# Altium schematic sheet FOC_DRV8323.SchDoc
size A2; SheetNumber: 1; SheetTotal: 1
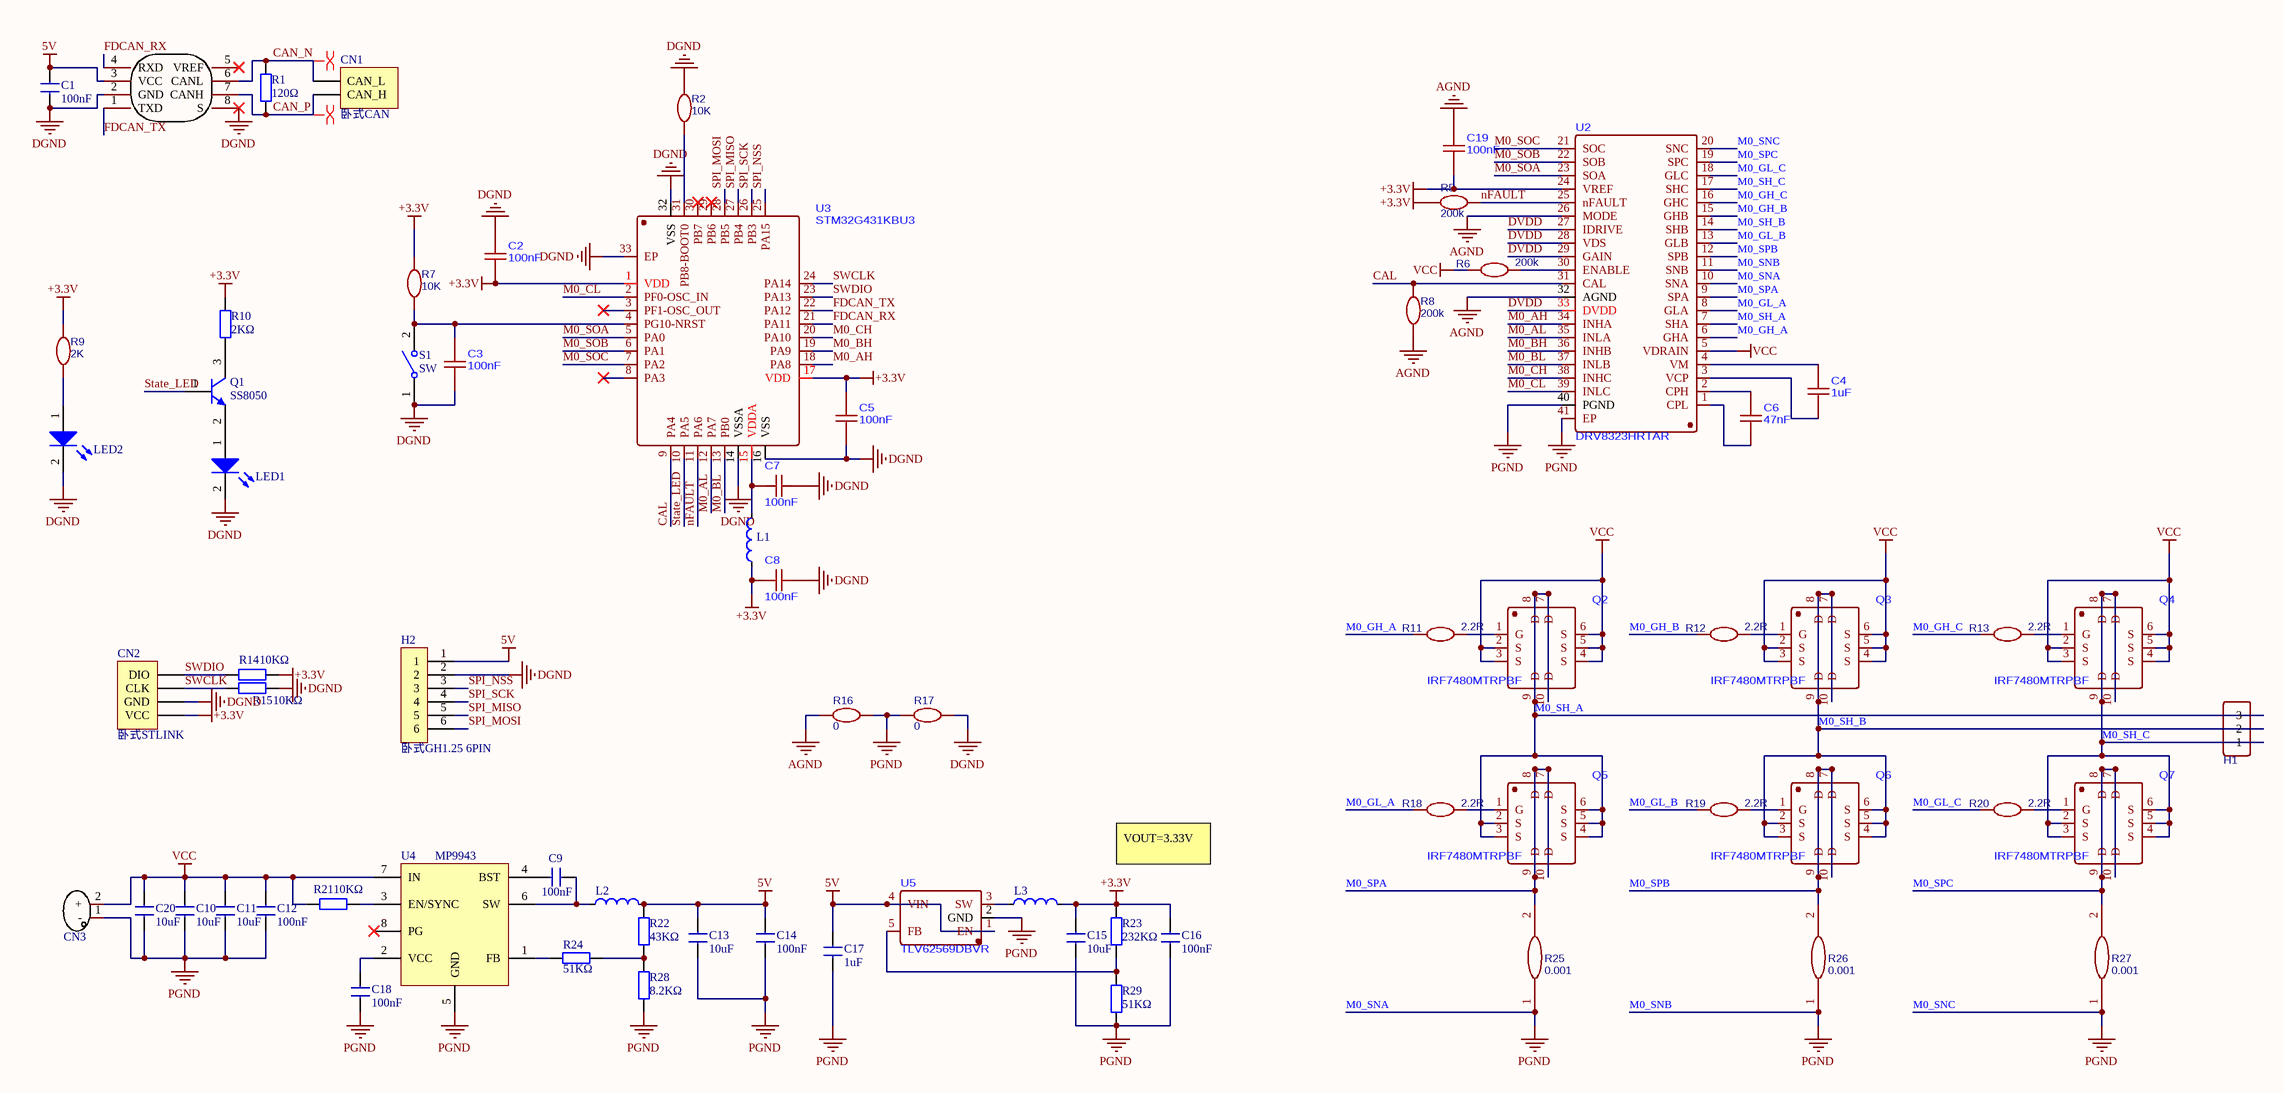
[diagram p0: FOC_DRV8323.SchDoc]

## Parts
C1  100nF  [c0402]
C2  100nF  [c0402]
C3  100nF  [c0402]
C4  1uF  [c0402]
C5  100nF  [c0402]
C6  47nF  [c0402]
C7  100nF  [c0402]
C8  100nF  [c0402]
C9  100nF  [c0402]
C10  10uF  [1210]
C11  10uF  [1210]
C12  100nF  [c0402]
C13  10uF  [1210]
C14  100nF  [c0402]
C15  10uF  [1210]
C16  100nF  [c0402]
C17  1uF  [c0402]
C18  100nF  [c0402]
C19  100nF  [c0402]
C20  10uF  [1210]
CN1  卧式CAN  [GH1.25 2P 卧式]
CN2  卧式STLINK  [CONN-SMD_4P-P1.25_GH1.25-4P]
CN3  XT30_1  [XT30卧式焊盘]  (value not drawn)
H1  MR30-M  [MR30]  (value not drawn)
H2  卧式GH1.25 6PIN  [CONN-SMD_6P-P1.25_XYECONN_XY-GH1.25-6A61]
L1  1008屏蔽电感  [R0603]  (value not drawn)
L2  1008屏蔽电感  [IND-SMD_L2.5-W2.0]  (value not drawn)
L3  1008屏蔽电感  [IND-SMD_L2.5-W2.0]  (value not drawn)
LED1  LED  [led0805]  (value not drawn)
LED2  LED  [led0805]  (value not drawn)
Q1  SS8050  [SOT-23-3_L2.9-W1.3-P1.90-LS2.4-BR]
Q2  IRF7480MTRPBF  [TRS-SMD_IRF7480MTRPBF]
Q3  IRF7480MTRPBF  [TRS-SMD_IRF7480MTRPBF]
Q4  IRF7480MTRPBF  [TRS-SMD_IRF7480MTRPBF]
Q5  IRF7480MTRPBF  [TRS-SMD_IRF7480MTRPBF]
Q6  IRF7480MTRPBF  [TRS-SMD_IRF7480MTRPBF]
Q7  IRF7480MTRPBF  [TRS-SMD_IRF7480MTRPBF]
R1  120Ω  [R0402]
R2  10K  [R0402]
R5  200k  [R0402]
R6  200k  [R0402]
R7  10K  [R0402]
R8  200k  [R0402]
R9  2K  [R0402]
R10  2KΩ  [R0402]
R11  2.2R  [R0402]
R12  2.2R  [R0402]
R13  2.2R  [R0402]
R14  10KΩ  [R0402]
R15  10KΩ  [R0402]
R16  0  [R0402]
R17  0  [R0402]
R18  2.2R  [R0402]
R19  2.2R  [R0402]
R20  2.2R  [R0402]
R21  10KΩ  [R0402]
R22  43KΩ  [R0402]
R23  232KΩ  [R0402]
R24  51KΩ  [R0402]
R25  0.001  [R0612]
R26  0.001  [R0612]
R27  0.001  [R0612]
R28  8.2KΩ  [R0402]
R29  51KΩ  [R0402]
S1  SW  [KEY_SMD]
U1  SN65HVD1050DR  [SOIC-8_L4.9-W3.9-P1.27-LS6.0-BL]  (value not drawn)
U2  DRV8323HRTAR  [QFN-40_L6.0-W6.0-P0.50-BL-EP4.5]
U3  STM32G431KBU3  [UFQFPN-32_L5.0-W5.0-P0.50-BL-EP3.5]
U4  MP9943  [QFN-8 3x3]
U5  TLV62569DBVR  [SOT-23-5_L3.0-W1.7-P0.95-LS2.8-BR]

## Nets
5V: C1.2 C13.2 C14.2 C17.2 H2.1 L2.2 R22.2 U1.3(VCC) U5.1(EN) U5.4(VIN)
+3.3V: C2.2 C5.2 C8.2 C15.2 C16.2 C19.1 CN2.1(VCC) L1.1 L3.2 R5.1 R7.1 R9.1 R10.2 R14.1 R23.2 U2.24(VREF) U3.1(VDD) U3.17(VDD)
AGND: C19.2 R8.2 R16.1 U2.26(MODE) U2.32(AGND)
DGND: C1.1 C2.1 C3.1 C5.1 C7.1 C8.1 CN2.2(GND) H2.2 LED1.2(K) LED2.2(K) R2.1 R15.2 R17.2 S1.1(COMMON) U1.2(GND) U1.8(S) U3.14(VSSA) U3.16(VSS) U3.32(VSS) U3.33(EP)
M0_SNA: C10.1 C11.1 C12.1 C13.1 C14.1 C15.1 C16.1 C17.1 C18.1 C20.1 CN3.1(-) R16.2 R17.1 R25.1 R26.1 R27.1 R28.1 R29.1 U2.10(SNA) U2.11(SNB) U2.20(SNC) U2.40(PGND) U2.41(EP) U4.5(GND) U5.2(GND)  [also labelled M0_SNB, M0_SNC, PGND]
VCC: C10.2 C11.2 C12.2 C20.2 CN3.2(+) Q2.2(S) Q2.3(S) Q2.4(S) Q2.5(S) Q2.6(S) Q3.2(S) Q3.3(S) Q3.4(S) Q3.5(S) Q3.6(S) Q4.2(S) Q4.3(S) Q4.4(S) Q4.5(S) Q4.6(S) R6.2 R21.1 U2.5(VDRAIN) U4.7(IN)
CAL: R8.1 U2.31(CAL) U3.9(PA4)
CAN_N: CN1.2(CAN_L) R1.2 U1.6(CANL)
CAN_P: CN1.1(CAN_H) R1.1 U1.7(CANH)
DVDD: U2.27(IDRIVE) U2.28(VDS) U2.29(GAIN) U2.33(DVDD)
FDCAN_RX: U1.4(RXD) U3.21(PA11)
FDCAN_TX: U1.1(TXD) U3.22(PA12)
M0_AH: U2.34(INHA) U3.18(PA8)
M0_AL: U2.35(INLA) U3.12(PA7)
M0_BH: U2.36(INHB) U3.19(PA9)
M0_BL: U2.37(INLB) U3.13(PB0)
M0_CH: U2.38(INHC) U3.20(PA10)
M0_CL: U2.39(INLC) U3.2(PF0-OSC_IN)
M0_GH_A: R11.2 U2.6(GHA)
M0_GH_B: R12.2 U2.15(GHB)
M0_GH_C: R13.2 U2.16(GHC)
M0_GL_A: R18.2 U2.8(GLA)
M0_GL_B: R19.2 U2.13(GLB)
M0_GL_C: R20.2 U2.18(GLC)
M0_SH_A: H1.3 Q2.7(D) Q2.8(D) Q2.9(D) Q2.10(D) Q5.2(S) Q5.3(S) Q5.4(S) Q5.5(S) Q5.6(S) U2.7(SHA)
M0_SH_B: H1.2 Q3.7(D) Q3.8(D) Q3.9(D) Q3.10(D) Q6.2(S) Q6.3(S) Q6.4(S) Q6.5(S) Q6.6(S) U2.14(SHB)
M0_SH_C: H1.1 Q4.7(D) Q4.8(D) Q4.9(D) Q4.10(D) Q7.2(S) Q7.3(S) Q7.4(S) Q7.5(S) Q7.6(S) U2.17(SHC)
M0_SOA: U2.23(SOA) U3.5(PA0)
M0_SOB: U2.22(SOB) U3.6(PA1)
M0_SOC: U2.21(SOC) U3.7(PA2)
M0_SPA: Q5.7(D) Q5.8(D) Q5.9(D) Q5.10(D) R25.2 U2.9(SPA)
M0_SPB: Q6.7(D) Q6.8(D) Q6.9(D) Q6.10(D) R26.2 U2.12(SPB)
M0_SPC: Q7.7(D) Q7.8(D) Q7.9(D) Q7.10(D) R27.2 U2.19(SPC)
nFAULT: R5.2 U2.25(nFAULT) U3.11(PA6)
SPI_MISO: H2.5 U3.27(PB4)
SPI_MOSI: H2.6 U3.28(PB5)
SPI_NSS: H2.3 U3.25(PA15)
SPI_SCK: H2.4 U3.26(PB3)
State_LED: Q1.1(B) U3.10(PA5)
SWCLK: CN2.3(CLK) R15.1 U3.24(PA14)
SWDIO: CN2.4(DIO) R14.2 U3.23(PA13)
NetC3_2: C3.2 R7.2 S1.2(NO) U3.4(PG10-NRST)
NetC4_1: C4.1 U2.3(VCP)
NetC4_2: C4.2 U2.4(VM)
NetC6_1: C6.1 U2.1(CPL)
NetC6_2: C6.2 U2.2(CPH)
NetC7_2: C7.2 L1.2 U3.15(VDDA)
NetC9_1: C9.1 U4.4(BST)
NetC9_2: C9.2 L2.1 U4.6(SW)
NetC18_2: C18.2 U4.2(VCC)
NetL3_1: L3.1 U5.3(SW)
NetLED1_1: LED1.1(A) Q1.2(E)
NetLED2_1: LED2.1(A) R9.2
NetQ1_3: Q1.3(C) R10.1
NetQ2_1: Q2.1(G) R11.1
NetQ3_1: Q3.1(G) R12.1
NetQ4_1: Q4.1(G) R13.1
NetQ5_1: Q5.1(G) R18.1
NetQ6_1: Q6.1(G) R19.1
NetQ7_1: Q7.1(G) R20.1
NetR2_2: R2.2 U3.31(PB8-BOOT0)
NetR6_1: R6.1 U2.30(ENABLE)
NetR21_2: R21.2 U4.3(EN/SYNC)
NetR22_1: R22.1 R24.2 R28.2
NetR23_1: R23.1 R29.2 U5.5(FB)
NetR24_1: R24.1 U4.1(FB)

Not connected (* = marked no-connect by the designer): U1 5(VREF)*; U3 3(PF1-OSC_OUT)* 8(PA3)* 29(PB6)* 30(PB7)*; U4 8(PG)*

## Layout directives
differential pair: CAN_N, CAN_P

## Notes on the sheet
- VOUT=3.33V

## Library data of the parts
C1 C9 C12 C14-C18 = 0402贴片电容: 贴片电容0402
C2-C8 C19 = CC0201JRX7R9BB101
C10 C11 C13 C20 = 1210贴片电容
H1 = MR30-M: BOM_Manufacturer: AMASS(艾迈斯); Contributor: LCEDA_Lib; BOM_Supplier Part: C99873; BOM_Supplier: LCSC; BOM_Manufacturer Part: MR30-M; spicePre: H; spiceSymbolName: HDR-F-2.54_1x3
LED1 LED2 = 0805贴片LED
Q1 = 2N2222: 三极管
R1 R10 R14 R15 R21-R24 R28 R29 = 0402贴片电阻: W: *
R2 R5-R9 R11-R13 R16-R20 = 2.2R: BOM_Manufacturer Part: 0603WAJ022JT5E; BOM_Manufacturer: UniOhm; nameAlias: Value(Ω); spicePre: R; spiceSymbolName: Res_0603(1/10W)_EU; BOM_Supplier: LCSC; BOM_Supplier Part: C25226
R25-R27 = 0.0005: BOM_Manufacturer: RALEC(旺诠); BOM_Manufacturer Part: LR2512-23R0005J4; nameAlias: Resistance (Ohms); Contributor: LCSC; BOM_Supplier: LCSC; BOM_Supplier Part: C2681067; spicePre: R; spiceSymbolName: LCSR2512FL500K9L
S1 = SW: 开关
U1 = SN65HVD1050DR: CAN芯片; Manufacturer: TI(德州仪器); Add into BOM: yes; Supply Voltage: 4.5V~5.5V; Supply Current: 50mA; Name: SN65HVD1050DR; Symbol: SN65HVD1050DR; Device: SN65HVD1050DR; LCSC Part Name: 4.5V~5.5V; Supplier Part: C14019; Manufacturer Part: SN65HVD1050DR; Supplier Footprint: SOIC-8; JLCPCB Part Class: Extended Part; Datasheet: https://www.ti.com/cn/lit/gpn/sn65hvd1050; Supplier: LCSC; Convert to PCB: yes; Type: 收发器; Operating Temperature: -40℃~+125℃
CN1 = 卧式CAN: LatestRevisionDate: 17-Jul-2002; LatestRevisionNote: Re-released for DXP Platform.; Publisher: Altium Limited